# Altium project 主控转接板-V2.0.PrjPCB
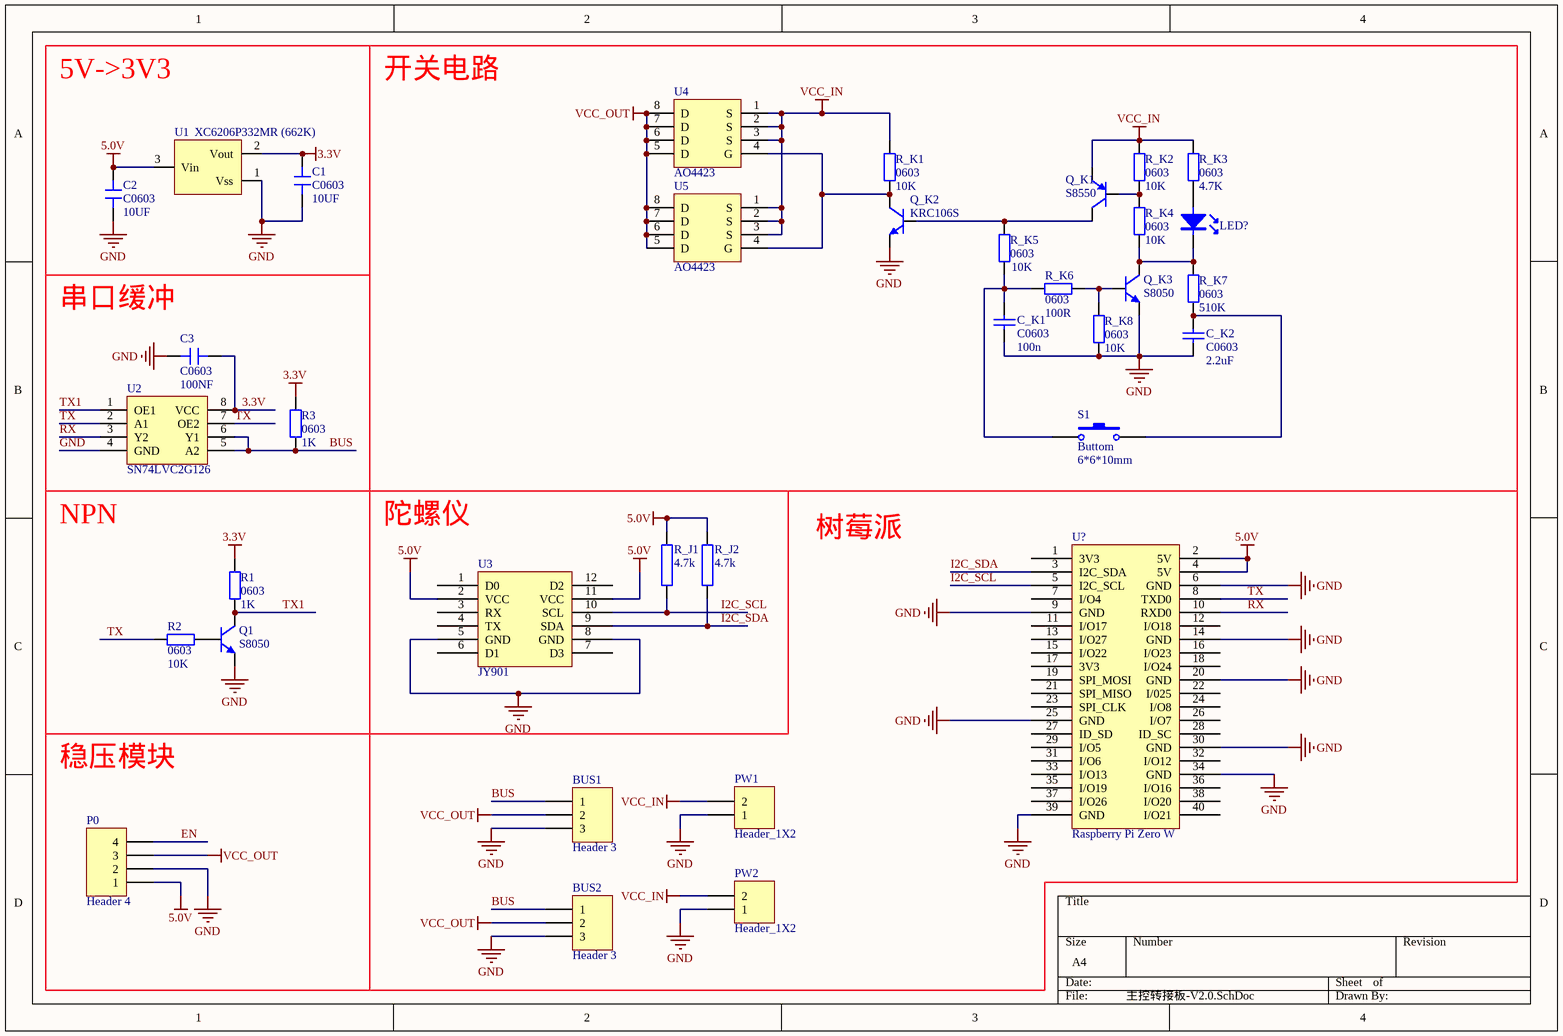
[diagram p0: 主控转接板-V2.0.SchDoc]
1 sheet, 35 parts. Net scope: global (net labels, ports and power ports of the same name join across sheets).
Board file: 主控转接板-V2.0.PcbDoc

## Sheet 主控转接板-V2.0.SchDoc
size A4

### Parts
BUS1  Header 3  [3P]
BUS2  Header 3  [3P]
C1  C0603  value 10UF  [Cap_0603]
C2  C0603  value 10UF  [Cap_0603]
C3  C0603  value 100NF  [Cap_0603]
C_K1  C0603  value 100n  [Cap_0603]
C_K2  C0603  value 2.2uF  [Cap_0603]
LED?  LED  [LED_0603]  (value not drawn)
P0  Header 4  [MP2315GJ]
PW1  Header_1X2  [2P]
PW2  Header_1X2  [2P]
Q1  S8050  [LC-SOT-23(SOT-23-3)]
Q_K1  S8550  [LC-SOT-23(SOT-23-3)]
Q_K2  KRC106S  [LC-SOT-23(SOT-23-3)]
Q_K3  S8050  [LC-SOT-23(SOT-23-3)]
R1  0603  value 1K  [Res_0603]
R2  0603  value 10K  [Res_0603]
R3  0603  value 1K  [Res_0603]
R_J1  4.7k  [Res_0603]
R_J2  4.7k  [Res_0603]
R_K1  0603  value 10K  [Res_0603]
R_K2  0603  value 10K  [Res_0603]
R_K3  0603  value 4.7K  [Res_0603]
R_K4  0603  value 10K  [Res_0603]
R_K5  0603  value 10K  [Res_0603]
R_K6  0603  value 100R  [Res_0603]
R_K7  0603  value 510K  [Res_0603]
R_K8  0603  value 10K  [Res_0603]
S1  Buttom  Packaging: 6*6*10mm  [Touch Switch]
U1  XC6206P332MR (662K)  [LC-SOT-23(SOT-23-3)]
U2  SN74LVC2G126  [VSSOP-8]
U3  JY901  [JY901]
U4  AO4423  [SOP-8 1]
U5  AO4423  [SOP-8 1]
U?  Raspberry Pi Zero W  [2.54 2*20PIN]

### Nets
3.3V: C1.2 C3.1 R1.2 R3.2 U1.2(Vout) U2.8(VCC)
5.0V: C2.2 P0.1 R_J1.1(TOP) R_J2.1(TOP) U1.3(Vin) U3.2(VCC) U3.11(VCC) U?.2(5V) U?.4(5V)
GND: BUS1.3 BUS2.3 C1.1 C2.1 C3.2 C_K1.1 C_K2.2 P0.2 PW1.1 PW2.1 Q1.2(E) Q_K2.2(E) Q_K3.2(E) R_K8.1 U1.1(Vss) U2.4(GND) U3.5(GND) U3.8(GND) U?.6(GND) U?.9(GND) U?.14(GND) U?.20(GND) U?.25(GND) U?.30(GND) U?.34(GND) U?.39(GND)
VCC_IN: PW1.2 PW2.2 Q_K1.2(E) R_K1.2 R_K2.2 R_K3.2 U4.1(S) U4.2(S) U4.3(S) U5.1(S) U5.2(S) U5.3(S)
VCC_OUT: BUS1.2 BUS2.2 P0.3 U4.5(D) U4.6(D) U4.7(D) U4.8(D) U5.5(D) U5.6(D) U5.7(D) U5.8(D)
BUS: BUS1.1 BUS2.1 R3.1 U2.5(A2) U2.6(Y1)
EN: P0.4
I2C_SCL: R_J1.2(BOT) U3.10(SCL) U?.5(I2C_SCL)
I2C_SDA: R_J2.2(BOT) U3.9(SDA) U?.3(I2C_SDA)
RX: U2.3(Y2) U?.10(RXD0)
TX: R2.2 U2.2(A1) U2.7(OE2) U?.8(TXD0)
TX1: Q1.3(C) R1.1 U2.1(OE1)
NetC_K1_2: C_K1.2 R_K5.1 R_K6.2 S1.1
NetC_K2_1: C_K2.1 R_K7.1 S1.2
NetLED?_A: LED?.A R_K3.1
NetLED?_K: LED?.K Q_K3.3(C) R_K4.1 R_K7.2
NetQ1_1: Q1.1(B) R2.1
NetQ_K1_1: Q_K1.1(B) R_K2.1 R_K4.2
NetQ_K1_3: Q_K1.3(C) Q_K2.1(B) R_K5.2
NetQ_K2_3: Q_K2.3(C) R_K1.1 U4.4(G) U5.4(G)
NetQ_K3_1: Q_K3.1(B) R_K6.1 R_K8.2

Not connected (* = marked no-connect by the designer): U3 1(D0) 3(RX) 4(TX) 6(D1) 7(D3) 12(D2); U? 1(3V3) 7(I/O4) 11(I/O17) 12(I/O18) 13(I/O27) 15(I/O22) 16(I/O23) 17(3V3) 18(I/O24) 19(SPI_MOSI) 21(SPI_MISO) 22(I/025) 23(SPI_CLK) 24(I/O8) 26(I/O7) 27(ID_SD) 28(ID_SC) 29(I/O5) 31(I/O6) 32(I/O12) 33(I/O13) 35(I/O19) 36(I/O16) 37(I/O26) 38(I/O20) 40(I/O21)

### Notes on the sheet
- 5V->3V3
- 开关电路
- 串口缓冲
- NPN
- 陀螺仪
- 树莓派
- 稳压模块

### Library data of the parts
BUS1 BUS2 = Header 3: Header, 3-Pin; LatestRevisionDate: 17-Jul-2002; LatestRevisionNote: Re-released for DXP Platform.; Publisher: Altium Limited
C1-C3 C_K1 C_K2 = Cap 1: Pressure resistance: 16V; Accuracy: 5%; Packaging: C0603
P0 = Header 4: Header, 4-Pin; LatestRevisionDate: 17-Jul-2002; LatestRevisionNote: Re-released for DXP Platform.; Publisher: Altium Limited
PW1 PW2 = Header_1X2: pin to pad: 1>2 2>1
Q1 Q_K2 Q_K3 = NPN: Published: 8-Jun-2000; LatestRevisionDate: 17-Jul-2002; LatestRevisionNote: Re-released for DXP Platform.; PackageReference: TO-226-AA; Publisher: Altium Limited; PackageDescription: TO, Flat Index; 3 In-Line, Axial Leads; Body Dia. 4.8mm; Leads 0.55 x 0.51 mm (max); Code_JEDEC: TO-226-AA; Packaging: *; value: *
Q_K1 = PNP: Published: 8-Jun-2000; LatestRevisionDate: 29-May-2009; LatestRevisionNote: IPC-7351 Footprint Added.; PackageVersion: Aug-1999; PackageReference: SOT-23B; Publisher: Altium Limited; PackageDescription: 3-Pin SOT-23 Package 0.95 mm Pitch, 2.4 mm Lead Span; Packaging: *; value: *
R1-R3 R_K1-R_K8 = Res2: Accuracy: 1%; Packaging: 0603
R_J1 R_J2 = RES: Resistor
U4 U5 = AO4423: value: P-MOS; Packaging: *
S1 = Buttom: Published: 24-Mar-1999; LatestRevisionDate: 17-Jul-2002; LatestRevisionNote: Re-released for DXP Platform.; PackageReference: SPST-2; Publisher: Altium Limited; PackageDescription: Switch; 2 Leads
U1 = XC6206P332MR (662K): Packaging: *
U2 = SN74LVC2G126: Packaging: *